# Altium schematic sheet analog channel.schdoc
size A4; DrawnBy: SML; Revision: 0; SheetNumber: 2; Title2: Title2
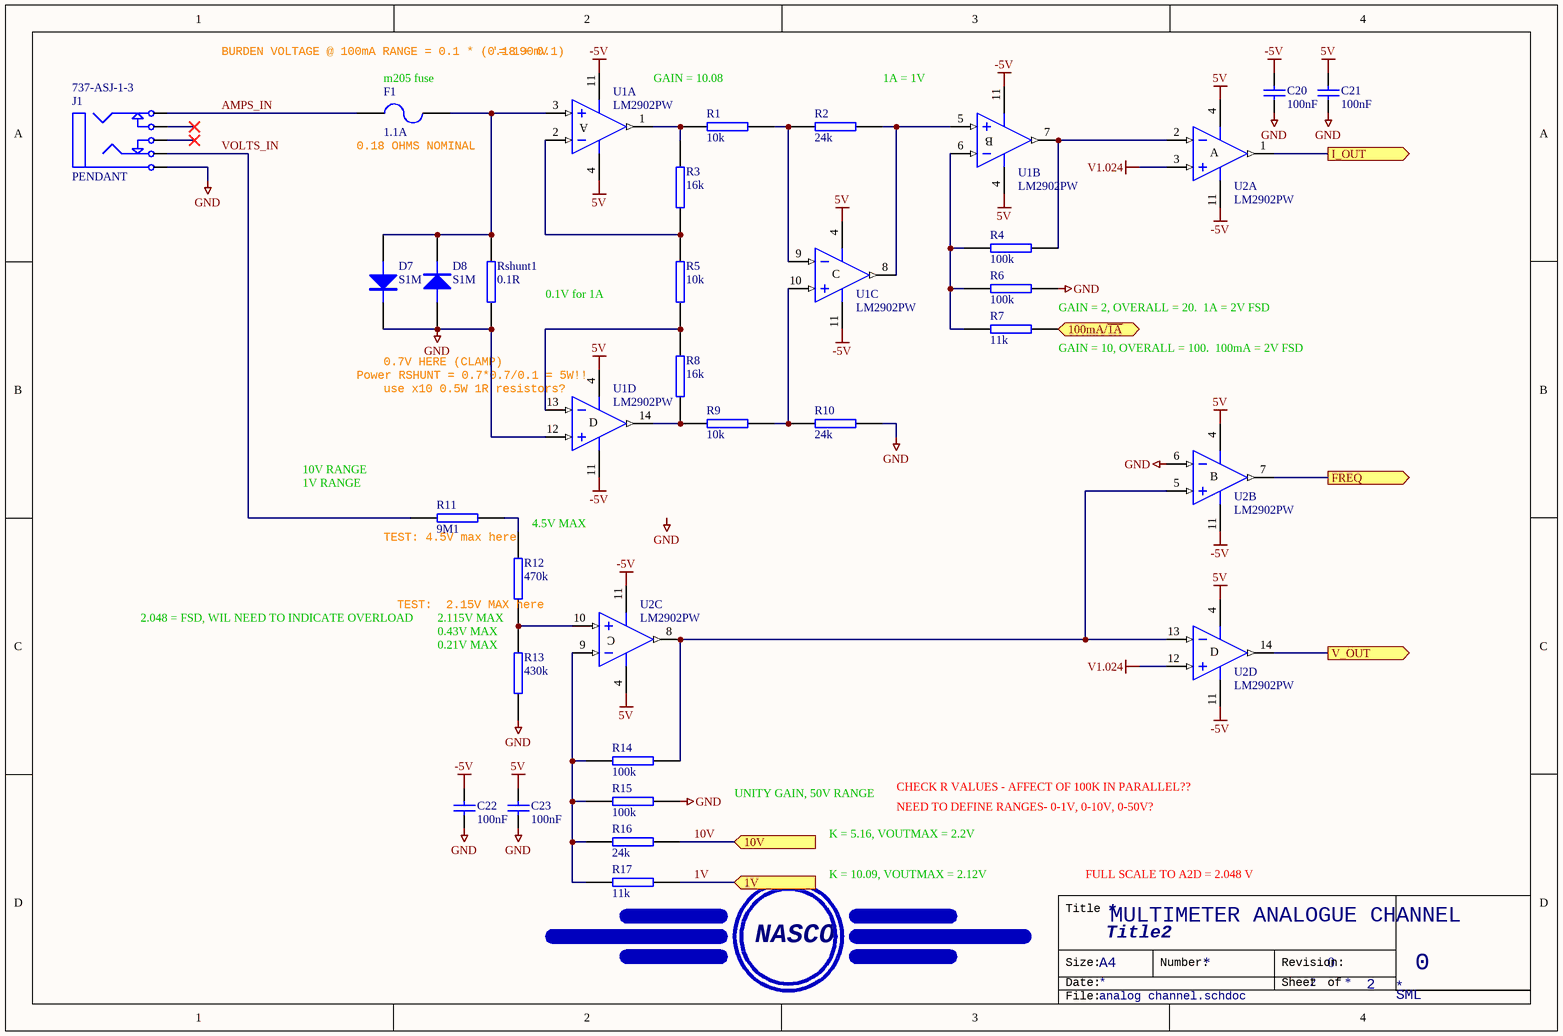
[diagram p0: analog channel.schdoc]

## Parts
?  (no value)  (no BOM)
C20  100nF  [CAP (3D) - 0603]
C21  100nF  [CAP (3D) - 0603]
C22  100nF  [CAP (3D) - 0603]
C23  100nF  [CAP (3D) - 0603]
D7  S1M  [DO-214AC]
D8  S1M  [DO-214AC]
F1  1.1A  [LITTELFUSE 1210]
J1  PENDANT  Supplier Part Number 1: 737-ASJ-1-3  [3.5MM pcb mouNt]
R1  10k  [RES (3D) - 0603]
R2  24k  [RES (3D) - 0603]
R3  16k  [RES (3D) - 0603]
R4  100k  [RES (3D) - 0603]
R5  10k  [RES (3D) - 0603]
R6  100k  [RES (3D) - 0603]
R7  11k  [RES (3D) - 0603]
R8  16k  [RES (3D) - 0603]
R9  10k  [RES (3D) - 0603]
R10  24k  [RES (3D) - 0603]
R11  9M1  [RES (3D) - 0603]
R12  470k  [RES (3D) - 0603]
R13  430k  [RES (3D) - 0603]
R14  100k  [RES (3D) - 0603]
R15  100k  [RES (3D) - 0603]
R16  24k  [RES (3D) - 0603]
R17  11k  [RES (3D) - 0603]
Rshunt1  0.1R  [1T-2512]
U1  LM2902PW  [PW014_N]  (parts A,B,C,D of 4)
U2  LM2902PW  [PW014_N]  (parts A,B,C,D of 4)

## Ports
1V (in), 10V (in), 100mA/~{1A} (in), FREQ (out), I_OUT (out), V_OUT (out)

## Nets
5V: C21.2 C23.2 U1.4(V+) U2.4(V+)
-5V: C20.2 C22.2 U1.11(V-) U2.11(V-)
GND: C20.1 C21.1 C22.1 C23.1 D7.2(K) D8.1(A) J1.1 R6.1 R10.1 R13.2 R15.1 Rshunt1.1 U1.12(IN+) U2.6(IN-)
V1.024: U2.3(IN+) U2.12(IN+)
1V: R17.1 ; port 1V
10V: R16.1 ; port 10V
100mA/~{1A}: R7.1 ; port 100mA/~{1A}
AMPS_IN: F1.1 J1.5
FREQ: U2.7(OUT) ; port FREQ
I_OUT: U2.1(OUT) ; port I_OUT
V_OUT: U2.14(OUT) ; port V_OUT
VOLTS_IN: J1.2 R11.1
NetD7_1: D7.1(A) D8.2(K) F1.2 Rshunt1.2 U1.3(IN+)
NetR1_1: R1.1 R2.2 U1.9(IN-)
NetR1_2: R1.2 R3.1 U1.1(OUT)
NetR2_1: R2.1 U1.5(IN+) U1.8(OUT)
NetR3_2: R3.2 R5.2 U1.2(IN-)
NetR4_1: R4.1 U1.7(OUT) U2.2(IN-)
NetR4_2: R4.2 R6.2 R7.2 U1.6(IN-)
NetR5_1: R5.1 R8.1 U1.13(IN-)
NetR8_2: R8.2 R9.2 U1.14(OUT)
NetR9_1: R9.1 R10.2 U1.10(IN+)
NetR11_2: R11.2 R12.1
NetR12_2: R12.2 R13.1 U2.10(IN+)
NetR14_1: R14.1 U2.5(IN+) U2.8(OUT) U2.13(IN-)
NetR14_2: R14.2 R15.2 R16.2 R17.2 U2.9(IN-)

Not connected (* = marked no-connect by the designer): J1 3* 4*

## Notes on the sheet
- BURDEN VOLTAGE @ 100mA RANGE = 0.1 * (0.18 + 0.1)
- (near F1) m205 fuse
- (near U1) '= 190mV
- GAIN = 10.08
- 1A = 1V
- (near F1) 0.18 OHMS NOMINAL
- 0.1V for 1A
- GAIN = 2, OVERALL = 20.  1A = 2V FSD
- (near U1) Power RSHUNT = 0.7*0.7/0.1 = 5W!!
- 0.7V HERE (CLAMP)
- (near R7) GAIN = 10, OVERALL = 100.  100mA = 2V FSD
- (near U1) use x10 0.5W 1R resistors?
- 10V RANGE
- 1V RANGE
- TEST: 4.5V max here
- (near R12) 4.5V MAX
- 2.048 = FSD, WIL NEED TO INDICATE OVERLOAD
- (near R12) TEST:  2.15V MAX here
- 2.115V MAX
- 0.43V MAX
- (near R13) 0.21V MAX
- CHECK R VALUES - AFFECT OF 100K IN PARALLEL??
- UNITY GAIN, 50V RANGE
- K = 5.16, VOUTMAX = 2.2V
- NEED TO DEFINE RANGES- 0-1V, 0-10V, 0-50V?
- K = 10.09, VOUTMAX = 2.12V
- FULL SCALE TO A2D = 2.048 V
- MULTIMETER ANALOGUE CHANNEL
- Labels drawn without touching a wire or pin: GND
- Title
- NASCO
- Size:
- Date:
- A4
- Number:
- Revision:
- Sheet
- of
- File:
- (in symbol LM2902PW, part A) A
- (in symbol LM2902PW, part B) B
- (in symbol LM2902PW, part C) C
- (in symbol LM2902PW, part D) D

## Library data of the parts
? = NASCO_LOGO: LOGO
C20-C23 = Cap: Capacitor; Value: 100nF; Supplier 1: Mouser; Supplier 2: Digi-Key; Supplier Part Number 1: 603-C0603ZRY5V9BB104; Supplier Part Number 2: 311-1343-2-ND
D7 D8 = DIODE: DIODE, POWER; Manufacturer: TAIWAN SEMI; Mouser Part no.: 821-S1M; Manufacturer Part No.: S1M; value: S1M; Web link: http://au.mouser.com/ProductDetail/Taiwan-Semiconductor/S1M/?qs=sGAEpiMZZMtEwUVCuofpuOlSmRjzJonf%252bmrIm0%252bGbjE%3d
F1 = Fuse 2: Fuse; Manufacturer: Littlefuse; Manufacturer Part No.: 1206L110THYR; Revision: July-2002: Re-released for DXP Platform.; Mouser Part No.: 576-1206L110THYR; Value: 1.1A; Web link: http://au.mouser.com/ProductDetail/Littelfuse/1206L110THYR/?qs=sGAEpiMZZMu7EFbsM1w0ne5Dyqsx7igC3NaPmo8Qtk8%3d
J1 = Phonejack Stereo SW: 3-Conductor Jack with 2 break contacts (normals) and 2 auxiliary make contacts; Altronics Part no.: P0073; Manufacturer: Neutrik; Manufacturer Part No.: NMJ6HFD2; Mouser Part no.: 550-20301; Web link: http://au.mouser.com/ProductDetail/Neutrik/NMJ6HFD2/?qs=y5MlCMoPWsng3r9W7xlRqw%3d%3d; Supplier 1: Mouser
R1-R10 R14-R17 = RES SMD 0603 10k: RESISTOR SMD 0603 10k; Manufacturer: Bourns; Manufacturer Part No.: CR0603FX-1002ELF; Mouser Part no.: 652-CR0603FX-1002ELF; Web link: http://au.mouser.com/Search/Refine.aspx?Keyword=652-CR0603FX-1002ELF
  R1 R5 R9: value: 10k
  R2 R10 R16: value: 24k
  R3 R8: value: 16k
  R4 R6 R14 R15: value: 100k
  R7 R17: value: 11k
R11 = RES SMD 0603 10k: RESISTOR SMD 0603 10k; Manufacturer: Vishay/Dale; Manufacturer Part No.: CRCW06038M06FKEA; Mouser Part no.: 71-CRCW0603-8.06M-E3; Web link: http://au.mouser.com/ProductDetail/Vishay/CRCW06038M06FKEA/?qs=y%252bMD5VLd6nuCUjzPeM%2fNuA%3d%3d; value: 9M1
R12 R13 = RES SMD 0603 10k: RESISTOR SMD 0603 10k; Manufacturer: 71-CRCW0603-1.62M-E3; Manufacturer Part No.: CRCW06031M62FKEA; Mouser Part no.: Vishay/Dale; Web link: http://au.mouser.com/ProductDetail/Vishay-Dale/CRCW06031M62FKEA/?qs=T8SocJY5PJGlLyODpclhGBx5u7VrWxQmuiInBv9Pchc%3d
  R12: value: 470k
  R13: value: 430k
Rshunt1 = RES SMD 0603 10k: RESISTOR SMD 0603; Manufacturer: Bourns; Manufacturer Part No.: CRM2512-FX-R100ELF; Mouser Part no.: 652-CRM2512FXR100ELF; Web link: http://au.mouser.com/ProductDetail/Bourns/CRM2512-FX-R100ELF/?qs=sGAEpiMZZMtlubZbdhIBIArpNfnoOiiHuLMy8C%2fxrAQ%3d; value: 0.1R
U1 U2 = LM2902PW: Quadruple Operational Amplifier